# Altium schematic sheet FPGA_Logic.SchDoc: FPGA Logic
size B; Author: Michael Jones; Engineer: Michael Jones; Organization: Group VIII Technology; Address1: 1652 W 820 N; Address2: Provo; Address3: UT  84601; Address4: 801-379-0118; DocumentNumber: 3; Revision: A3; SheetNumber: 3; SheetTotal: 6
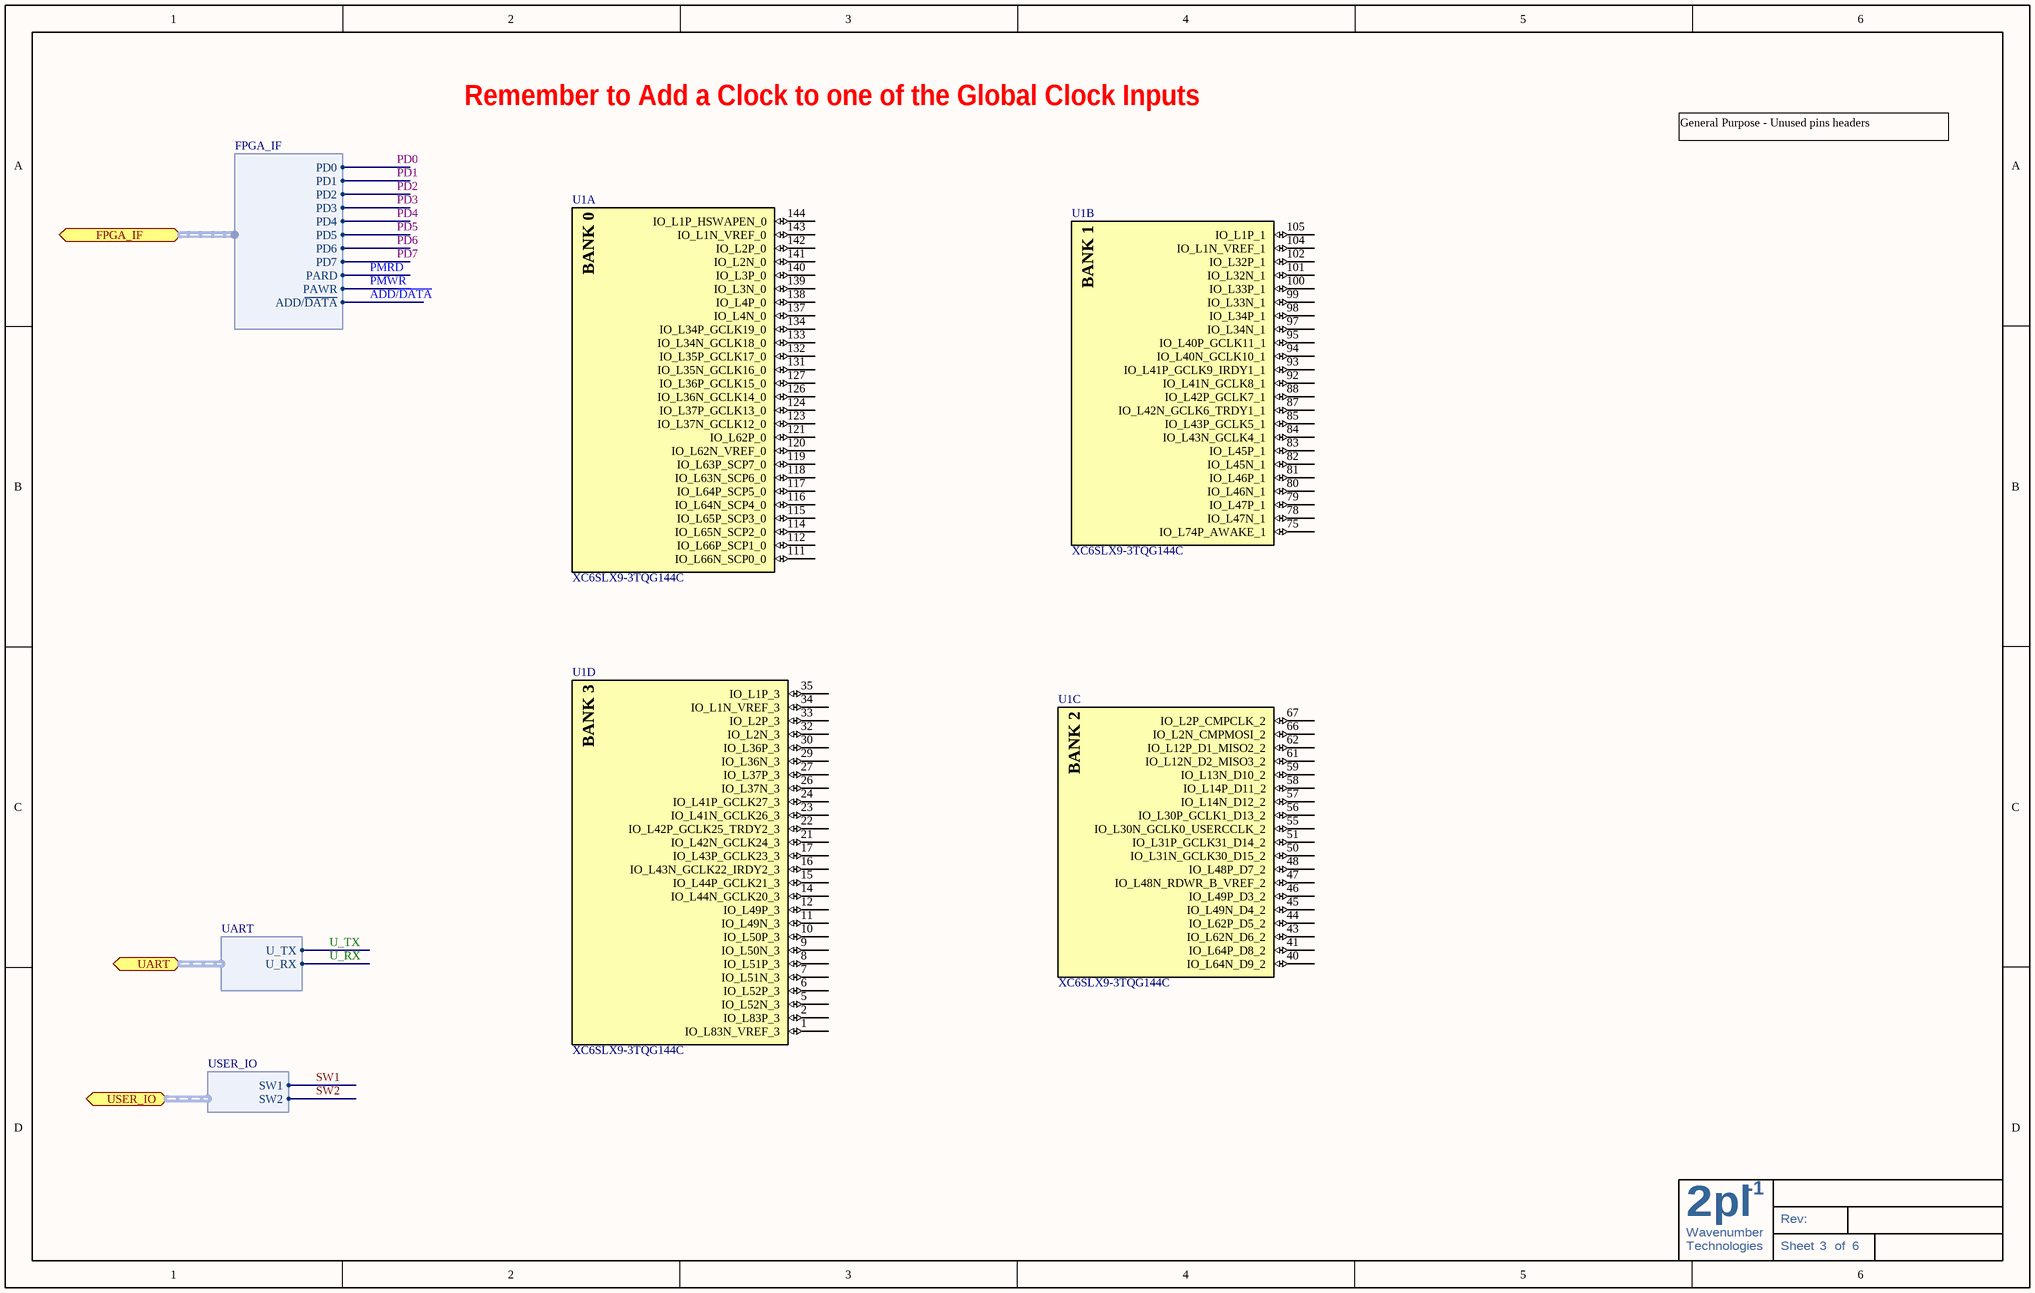
[diagram p0: FPGA_Logic.SchDoc]

## Parts
U1  XC6SLX9-3TQG144C  [TQ144_L]  (parts A,B,C,D of 7)

## Ports
FPGA_IF (harness FPGA_IF), UART (harness UART), USER_IO (harness USER_IO)

## Harnesses
USER_IO: SW1, SW2
UART: U_TX, U_RX
FPGA_IF: PD0, PD1, PD2, PD3, PD4, PD5, PD6, PD7, PARD, PAWR, ADD/~{DATA}

## Nets
ADD/~{DATA}: port FPGA_IF.ADD/~{DATA}
PD0: port FPGA_IF.PD0
PD1: port FPGA_IF.PD1
PD2: port FPGA_IF.PD2
PD3: port FPGA_IF.PD3
PD4: port FPGA_IF.PD4
PD5: port FPGA_IF.PD5
PD6: port FPGA_IF.PD6
PD7: port FPGA_IF.PD7
PMRD: port FPGA_IF.PARD
PMWR: port FPGA_IF.PAWR
SW1: port USER_IO.SW1
SW2: port USER_IO.SW2
U_RX: port UART.U_RX
U_TX: port UART.U_TX

Not connected (* = marked no-connect by the designer): U1 1(IO_L83N_VREF_3) 2(IO_L83P_3) 5(IO_L52N_3) 6(IO_L52P_3) 7(IO_L51N_3) 8(IO_L51P_3) 9(IO_L50N_3) 10(IO_L50P_3) 11(IO_L49N_3) 12(IO_L49P_3) 14(IO_L44N_GCLK20_3) 15(IO_L44P_GCLK21_3) 16(IO_L43N_GCLK22_IRDY2_3) 17(IO_L43P_GCLK23_3) 21(IO_L42N_GCLK24_3) 22(IO_L42P_GCLK25_TRDY2_3) 23(IO_L41N_GCLK26_3) 24(IO_L41P_GCLK27_3) 26(IO_L37N_3) 27(IO_L37P_3) 29(IO_L36N_3) 30(IO_L36P_3) 32(IO_L2N_3) 33(IO_L2P_3) 34(IO_L1N_VREF_3) 35(IO_L1P_3) 40(IO_L64N_D9_2) 41(IO_L64P_D8_2) 43(IO_L62N_D6_2) 44(IO_L62P_D5_2) 45(IO_L49N_D4_2) 46(IO_L49P_D3_2) 47(IO_L48N_RDWR_B_VREF_2) 48(IO_L48P_D7_2) 50(IO_L31N_GCLK30_D15_2) 51(IO_L31P_GCLK31_D14_2) 55(IO_L30N_GCLK0_USERCCLK_2) 56(IO_L30P_GCLK1_D13_2) 57(IO_L14N_D12_2) 58(IO_L14P_D11_2) 59(IO_L13N_D10_2) 61(IO_L12N_D2_MISO3_2) 62(IO_L12P_D1_MISO2_2) 66(IO_L2N_CMPMOSI_2) 67(IO_L2P_CMPCLK_2) 75(IO_L74P_AWAKE_1) 78(IO_L47N_1) 79(IO_L47P_1) 80(IO_L46N_1) 81(IO_L46P_1) 82(IO_L45N_1) 83(IO_L45P_1) 84(IO_L43N_GCLK4_1) 85(IO_L43P_GCLK5_1) 87(IO_L42N_GCLK6_TRDY1_1) 88(IO_L42P_GCLK7_1) 92(IO_L41N_GCLK8_1) 93(IO_L41P_GCLK9_IRDY1_1) 94(IO_L40N_GCLK10_1) 95(IO_L40P_GCLK11_1) 97(IO_L34N_1) 98(IO_L34P_1) 99(IO_L33N_1) 100(IO_L33P_1) 101(IO_L32N_1) 102(IO_L32P_1) 104(IO_L1N_VREF_1) 105(IO_L1P_1) 111(IO_L66N_SCP0_0) 112(IO_L66P_SCP1_0) 114(IO_L65N_SCP2_0) 115(IO_L65P_SCP3_0) 116(IO_L64N_SCP4_0) 117(IO_L64P_SCP5_0) 118(IO_L63N_SCP6_0) 119(IO_L63P_SCP7_0) 120(IO_L62N_VREF_0) 121(IO_L62P_0) 123(IO_L37N_GCLK12_0) 124(IO_L37P_GCLK13_0) 126(IO_L36N_GCLK14_0) 127(IO_L36P_GCLK15_0) 131(IO_L35N_GCLK16_0) 132(IO_L35P_GCLK17_0) 133(IO_L34N_GCLK18_0) 134(IO_L34P_GCLK19_0) 137(IO_L4N_0) 138(IO_L4P_0) 139(IO_L3N_0) 140(IO_L3P_0) 141(IO_L2N_0) 142(IO_L2P_0) 143(IO_L1N_VREF_0) 144(IO_L1P_HSWAPEN_0)

## Notes on the sheet
- Remember to Add a Clock to one of the Global Clock Inputs
- General Purpose - Unused pins headers
- 2
- Wavenumber
- pl
- -1
- Rev:
- Technologies
- Sheet
- of
- (in symbol XC6SLX9-3TQG144C, part A) BANK 0
- (in symbol XC6SLX9-3TQG144C, part B) BANK 1
- (in symbol XC6SLX9-3TQG144C, part C) BANK 2
- (in symbol XC6SLX9-3TQG144C, part D) BANK 3

## Library data of the parts
U1 = XC6SLX9-3TQG144C: IC FPAG SPARTAN 6 9K 144TQFP; Manufacturer: Xilinx Inc; Number of Logic Elements/Cells: 9152; Number of LABs/CLBs: 715; Total RAM Bits: 589824; Number of I /O: 102; Voltage - Supply: 1.14 V ~ 1.26 V; Supplier 1: Digi-Key; Supplier Part Number 1: 122-1747-ND; Manufacturer Part Number: XC6SLX9-3TQG144C; RoHS: RoHS Compliant; Category: Integrated Circuits (ICs); Stock 1: 77; Pricing 1: 1=17.22 (USD); Number of Gates: -; Mounting Type: Surface Mount; Operating Temperature: 0°C ~ 85°C; Package / Case: 144-LQFP; Supplier Device Package: 144-TQFP (20x20); ComponentLink1URL: http://www.xilinx.com/support/documentation/data_sheets/ds160.pdf; ComponentLink1Description: http://www.xilinx.com/support/documentation/data_sheets/ds160.pdf; Value: XC6SLX9-3TQG144C